# EAGLE board Rev 1 (EAGLE 9.2.2), part 1 of 2
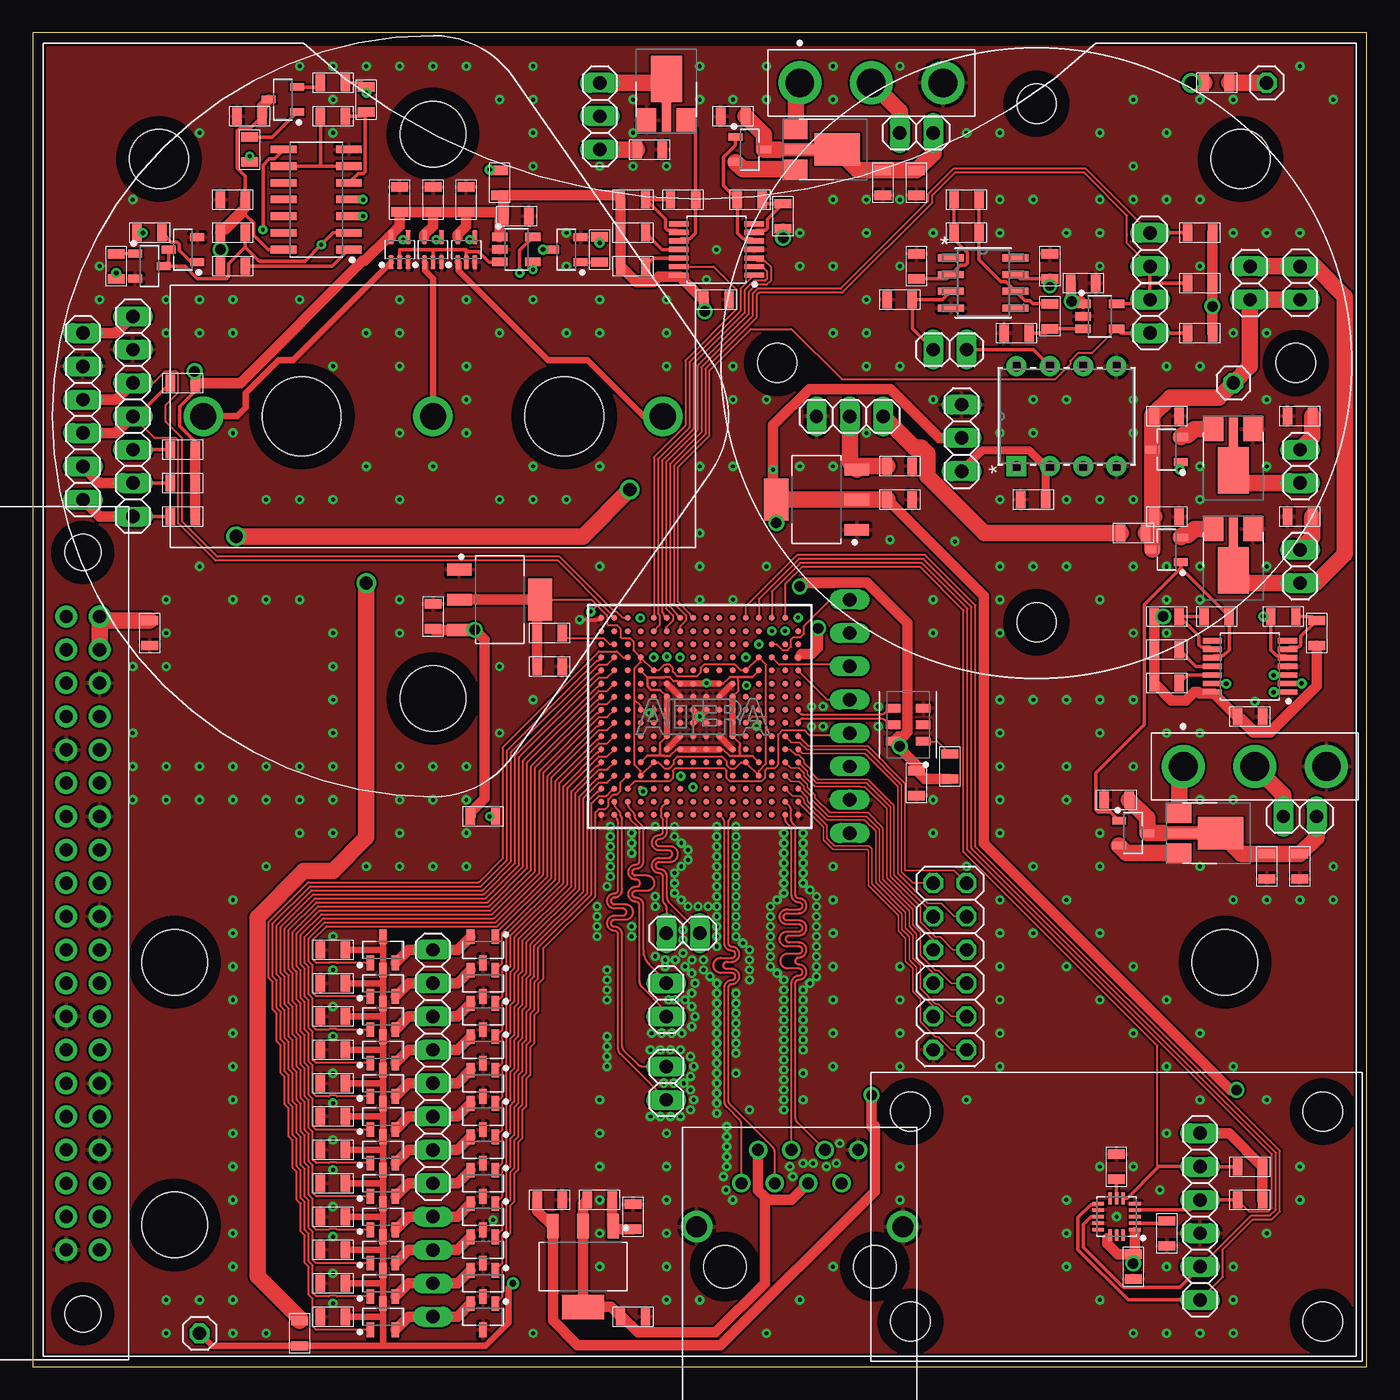
[diagram p12: board, top side]
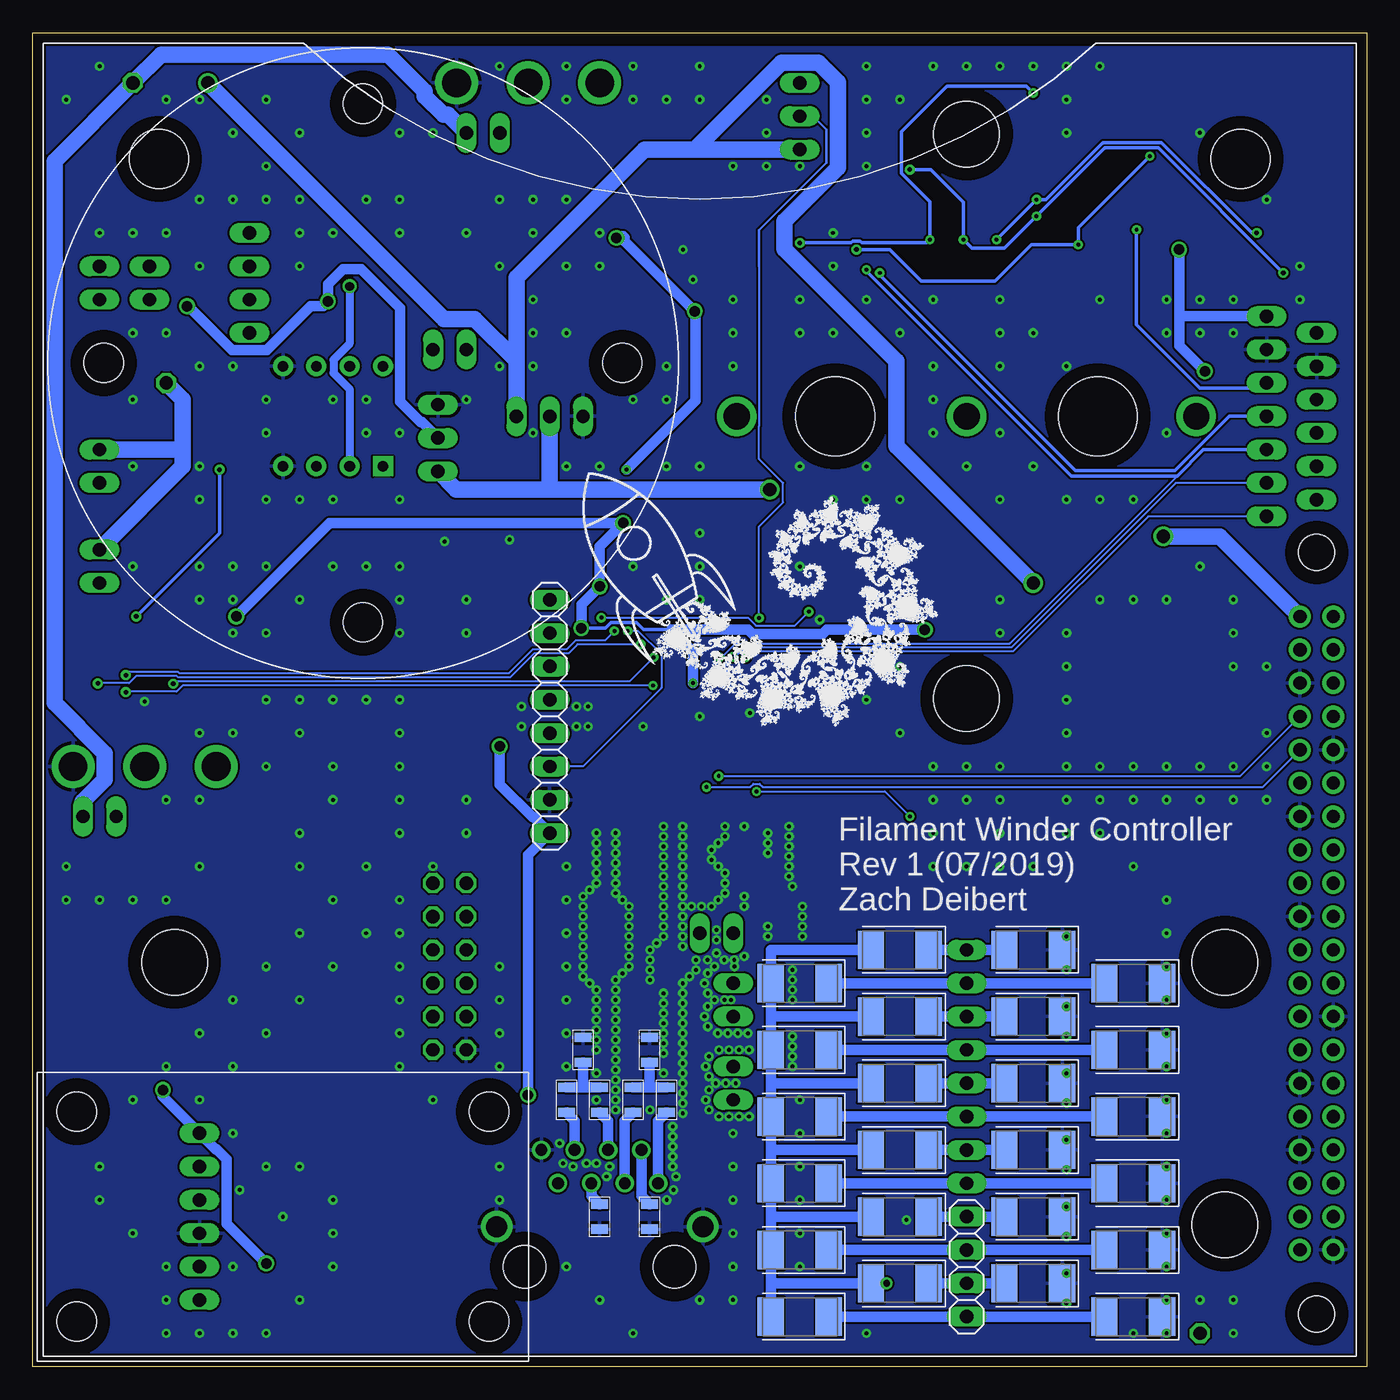
[diagram p13: board, bottom side, seen from below]

Size 101.6 x 101.6 mm. Coordinates in mm from the lower left corner, seen from the top.
Outline: 0,0 101.6,0 101.6,101.6 0,101.6 0,0
Copper layers (1*16): Top 0.035mm / dielectric 1.5mm / Bottom 0.035mm
Design rules "default *": minimum track width 5mil, minimum drill 0.3mm, track to track 6mil, track to pad 6mil, pad to pad 6mil, via to via 6mil, smd to smd 0mil, copper to edge 40mil, drill to drill 6mil, minimum pad ring 10mil, minimum via ring 8mil, stop-mask expansion 4mil, vias tented up to drill 0mil, thermal gap 10mil

## Footprints (pad centres in the part's own frame; a part is rotated, then mirrored left to right if it is on the bottom)
0805 = smd 0.711 x 1.295: P$1 -0.953,0; P$2 0.953,0
DIOC5327X220 = smd 2.002 x 2.915: 1 -2.203,0; 2 2.203,0
1X04 = drill 1.016 long: 1 -3.81,0; 2 -1.27,0; 3 1.27,0; 4 3.81,0
1X02 = drill 1.016 long: 1 -1.27,0; 2 1.27,0
1X03 = drill 1.016 long: 1 -2.54,0; 2 0,0; 3 2.54,0
1X06 = drill 1.016 long: 1 -6.35,0; 2 -3.81,0; 3 -1.27,0; 4 1.27,0; 5 3.81,0; 6 6.35,0
2X06 = drill 1.016 octagon: 1 -6.35,-1.27; 2 -6.35,1.27; 3 -3.81,-1.27; 4 -3.81,1.27; 5 -1.27,-1.27; 6 -1.27,1.27; 7 1.27,-1.27; 8 1.27,1.27; 9 3.81,-1.27; 10 3.81,1.27; 11 6.35,-1.27; 12 6.35,1.27
1X07 = drill 1.016 long: 1 -7.62,0; 2 -5.08,0; 3 -2.54,0; 4 0,0; 5 2.54,0; 6 5.08,0; 7 7.62,0
1X08 = drill 1.016 long: 1 -8.89,0; 2 -6.35,0; 3 -3.81,0; 4 -1.27,0; 5 1.27,0; 6 3.81,0; 7 6.35,0; 8 8.89,0
1X01 = drill 1.016 octagon: 1 0,0
5-2301994-4 = drill 1.6: G1 -7.85,-4.57; G2 7.85,-4.57 | drill 0.9: P1 -4.445,-1.27; P2 -3.175,1.27; P3 -1.905,-1.27; P4 -0.635,1.27; P5 0.635,-1.27; P6 1.905,1.27; P7 3.175,-1.27; P8 4.445,1.27 | hole 3.25: -5.715,-7.62; 5.715,-7.62
SOT23-3 = smd 1.122 x 0.582: 1 -1,0.95; 2 -1,-0.95; 3 1,0
SOT150P400X160-4 = smd 1.8 x 1.45: 1 -1.569,1.5; 3 -1.569,-1.5 | smd 4.9 x 0.7: 2 0,0 | smd 3.5 x 2.4: 4 1.569,0
SOT95P230X110-3 = smd 1.059 x 0.59: 1 -1.078,0.95; 2 -1.078,-0.95; 3 1.078,0
HDRV3W140P545_1X3_1560X508X838B = drill 2.18 pad 3.27: 1 0,0; 2 5.45,0; 3 10.9,0
POTENTIOMETER = drill 2 pad 3: P$1 0,0
FBGA256 = smd 0.45 x 0.45: A1 -7.5,7.5; A2 -6.5,7.5; A3 -5.5,7.5; A4 -4.5,7.5; A5 -3.5,7.5; A6 -2.5,7.5; A7 -1.5,7.5; A8 -0.5,7.5; A9 0.5,7.5; A10 1.5,7.5; A11 2.5,7.5; A12 3.5,7.5; A13 4.5,7.5; A14 5.5,7.5; A15 6.5,7.5; A16 7.5,7.5; B1 -7.5,6.5; B2 -6.5,6.5; B3 -5.5,6.5; B4 -4.5,6.5; B5 -3.5,6.5; B6 -2.5,6.5; B7 -1.5,6.5; B8 -0.5,6.5; B9 0.5,6.5; B10 1.5,6.5; B11 2.5,6.5; B12 3.5,6.5; B13 4.5,6.5; B14 5.5,6.5; B15 6.5,6.5; B16 7.5,6.5; C1 -7.5,5.5; C2 -6.5,5.5; C3 -5.5,5.5; C4 -4.5,5.5; C5 -3.5,5.5; C6 -2.5,5.5; C7 -1.5,5.5; C8 -0.5,5.5; C9 0.5,5.5; C10 1.5,5.5; C11 2.5,5.5; C12 3.5,5.5; C13 4.5,5.5; C14 5.5,5.5; C15 6.5,5.5; C16 7.5,5.5; D1 -7.5,4.5; D2 -6.5,4.5; D3 -5.5,4.5; D4 -4.5,4.5; D5 -3.5,4.5; D6 -2.5,4.5; D7 -1.5,4.5; D8 -0.5,4.5; D9 0.5,4.5; D10 1.5,4.5; D11 2.5,4.5; D12 3.5,4.5; D13 4.5,4.5; D14 5.5,4.5; D15 6.5,4.5; D16 7.5,4.5; E1 -7.5,3.5; E2 -6.5,3.5; E3 -5.5,3.5; E4 -4.5,3.5; E5 -3.5,3.5; E6 -2.5,3.5; E7 -1.5,3.5; E8 -0.5,3.5; E9 0.5,3.5; E10 1.5,3.5; E11 2.5,3.5; E12 3.5,3.5; E13 4.5,3.5; E14 5.5,3.5; E15 6.5,3.5; E16 7.5,3.5; F1 -7.5,2.5; F2 -6.5,2.5; F3 -5.5,2.5; F4 -4.5,2.5; F5 -3.5,2.5; F6 -2.5,2.5; F7 -1.5,2.5; F8 -0.5,2.5; F9 0.5,2.5; F10 1.5,2.5; F11 2.5,2.5; F12 3.5,2.5; F13 4.5,2.5; F14 5.5,2.5; F15 6.5,2.5; F16 7.5,2.5; G1 -7.5,1.5; G2 -6.5,1.5; G3 -5.5,1.5; G4 -4.5,1.5; G5 -3.5,1.5; G6 -2.5,1.5; G7 -1.5,1.5; G8 -0.5,1.5; G9 0.5,1.5; G10 1.5,1.5; G11 2.5,1.5; G12 3.5,1.5; G13 4.5,1.5; G14 5.5,1.5; G15 6.5,1.5; G16 7.5,1.5; H1 -7.5,0.5; H2 -6.5,0.5; H3 -5.5,0.5; H4 -4.5,0.5; H5 -3.5,0.5; H6 -2.5,0.5; H7 -1.5,0.5; H8 -0.5,0.5; H9 0.5,0.5; H10 1.5,0.5; H11 2.5,0.5; H12 3.5,0.5; H13 4.5,0.5; H14 5.5,0.5; H15 6.5,0.5; H16 7.5,0.5; J1 -7.5,-0.5; J2 -6.5,-0.5; J3 -5.5,-0.5; J4 -4.5,-0.5; J5 -3.5,-0.5; J6 -2.5,-0.5; J7 -1.5,-0.5; J8 -0.5,-0.5; J9 0.5,-0.5; J10 1.5,-0.5; J11 2.5,-0.5; J12 3.5,-0.5; J13 4.5,-0.5; J14 5.5,-0.5; J15 6.5,-0.5; J16 7.5,-0.5; K1 -7.5,-1.5; K2 -6.5,-1.5; K3 -5.5,-1.5; K4 -4.5,-1.5; K5 -3.5,-1.5; K6 -2.5,-1.5; K7 -1.5,-1.5; K8 -0.5,-1.5; K9 0.5,-1.5; K10 1.5,-1.5; K11 2.5,-1.5; K12 3.5,-1.5; K13 4.5,-1.5; K14 5.5,-1.5; K15 6.5,-1.5; K16 7.5,-1.5; L1 -7.5,-2.5; L2 -6.5,-2.5; L3 -5.5,-2.5; L4 -4.5,-2.5; L5 -3.5,-2.5; L6 -2.5,-2.5; L7 -1.5,-2.5; L8 -0.5,-2.5; L9 0.5,-2.5; L10 1.5,-2.5; L11 2.5,-2.5; L12 3.5,-2.5; L13 4.5,-2.5; L14 5.5,-2.5; L15 6.5,-2.5; L16 7.5,-2.5; M1 -7.5,-3.5; M2 -6.5,-3.5; M3 -5.5,-3.5; M4 -4.5,-3.5; M5 -3.5,-3.5; M6 -2.5,-3.5; M7 -1.5,-3.5; M8 -0.5,-3.5; M9 0.5,-3.5; M10 1.5,-3.5; M11 2.5,-3.5; M12 3.5,-3.5; M13 4.5,-3.5; M14 5.5,-3.5; M15 6.5,-3.5; M16 7.5,-3.5; N1 -7.5,-4.5; N2 -6.5,-4.5; N3 -5.5,-4.5; N4 -4.5,-4.5; N5 -3.5,-4.5; N6 -2.5,-4.5; N7 -1.5,-4.5; N8 -0.5,-4.5; N9 0.5,-4.5; N10 1.5,-4.5; N11 2.5,-4.5; N12 3.5,-4.5; N13 4.5,-4.5; N14 5.5,-4.5; N15 6.5,-4.5; N16 7.5,-4.5; P1 -7.5,-5.5; P2 -6.5,-5.5; P3 -5.5,-5.5; P4 -4.5,-5.5; P5 -3.5,-5.5; P6 -2.5,-5.5; P7 -1.5,-5.5; P8 -0.5,-5.5; P9 0.5,-5.5; P10 1.5,-5.5; P11 2.5,-5.5; P12 3.5,-5.5; P13 4.5,-5.5; P14 5.5,-5.5; P15 6.5,-5.5; P16 7.5,-5.5; R1 -7.5,-6.5; R2 -6.5,-6.5; R3 -5.5,-6.5; R4 -4.5,-6.5; R5 -3.5,-6.5; R6 -2.5,-6.5; R7 -1.5,-6.5; R8 -0.5,-6.5; R9 0.5,-6.5; R10 1.5,-6.5; R11 2.5,-6.5; R12 3.5,-6.5; R13 4.5,-6.5; R14 5.5,-6.5; R15 6.5,-6.5; R16 7.5,-6.5; T1 -7.5,-7.5; T2 -6.5,-7.5; T3 -5.5,-7.5; T4 -4.5,-7.5; T5 -3.5,-7.5; T6 -2.5,-7.5; T7 -1.5,-7.5; T8 -0.5,-7.5; T9 0.5,-7.5; T10 1.5,-7.5; T11 2.5,-7.5; T12 3.5,-7.5; T13 4.5,-7.5; T14 5.5,-7.5; T15 6.5,-7.5; T16 7.5,-7.5
SOP65P640X120-14 = smd 1.469 x 0.407: 1 -2.871,1.95; 2 -2.871,1.3; 3 -2.871,0.65; 4 -2.871,0; 5 -2.871,-0.65; 6 -2.871,-1.3; 7 -2.871,-1.95; 8 2.871,-1.95; 9 2.871,-1.3; 10 2.871,-0.65; 11 2.871,0; 12 2.871,0.65; 13 2.871,1.3; 14 2.871,1.95
16QFN = smd 0.904 x 0.264: 1 -1.404,1; 2 -1.404,0.5; 3 -1.404,0; 4 -1.404,-0.5; 5 -1.404,-1; 9 1.404,-1; 10 1.404,-0.5; 11 1.404,0; 12 1.404,0.5; 13 1.404,1 | smd 0.264 x 0.904: 6 -0.5,-1.404; 7 0,-1.404; 8 0.5,-1.404; 14 0.5,1.404; 15 0,1.404; 16 -0.5,1.404
TSSOP5 = smd 1.062 x 0.397: 1 -0.956,0.65; 2 -0.956,0; 3 -0.956,-0.65; 4 0.956,-0.65; 5 0.956,0.65
SOT23-5 = smd 1.186 x 0.639: 1 -1.264,0.95; 2 -1.264,0; 3 -1.264,-0.95; 4 1.264,-0.95; 5 1.264,0.95
SOIC127P600X175-14 = smd 1.952 x 0.589: 1 -2.482,3.81; 2 -2.482,2.54; 3 -2.482,1.27; 4 -2.482,0; 5 -2.482,-1.27; 6 -2.482,-2.54; 7 -2.482,-3.81; 8 2.482,-3.81; 9 2.482,-2.54; 10 2.482,-1.27; 11 2.482,0; 12 2.482,1.27; 13 2.482,2.54; 14 2.482,3.81
RPI = drill 1 pad 1.676: 1 -1.27,24.13; 2 1.27,24.13; 3 -1.27,21.59; 4 1.27,21.59; 5 -1.27,19.05; 6 1.27,19.05; 7 -1.27,16.51; 8 1.27,16.51; 9 -1.27,13.97; 10 1.27,13.97; 11 -1.27,11.43; 12 1.27,11.43; 13 -1.27,8.89; 14 1.27,8.89; 15 -1.27,6.35; 16 1.27,6.35; 17 -1.27,3.81; 18 1.27,3.81; 19 -1.27,1.27; 20 1.27,1.27; 21 -1.27,-1.27; 22 1.27,-1.27; 23 -1.27,-3.81; 24 1.27,-3.81; 25 -1.27,-6.35; 26 1.27,-6.35; 27 -1.27,-8.89; 28 1.27,-8.89; 29 -1.27,-11.43; 30 1.27,-11.43; 31 -1.27,-13.97; 32 1.27,-13.97; 33 -1.27,-16.51; 34 1.27,-16.51; 35 -1.27,-19.05; 36 1.27,-19.05; 37 -1.27,-21.59; 38 1.27,-21.59; 39 -1.27,-24.13; 40 1.27,-24.13 | hole 2.75: 0,29; 0,-29
SOT230P700X180-4 = smd 1.86 x 0.898: 1 -3.075,2.3; 2 -3.075,0; 3 -3.075,-2.3 | smd 1.86 x 3.189: 4 3.075,0
N_8 = drill 0.813 pad 1.524 square: 1 -7.62,7.62 | drill 0.813 pad 1.524: 2 -7.62,5.08; 3 -7.62,2.54; 4 -7.62,0; 5 0,0; 6 0,2.54; 7 0,5.08; 8 0,7.62
SO-8_S = smd 1.981 x 0.533: 1 -2.464,1.905; 2 -2.464,0.635; 3 -2.464,-0.635; 4 -2.464,-1.905; 5 2.464,-1.905; 6 2.464,-0.635; 7 2.464,0.635; 8 2.464,1.905
PCB_ACCEL = hole 3: -8,15.7; 8,15.7; -8,-15.7; 8,-15.7
PCB_MAIN = hole 5: -40,-40; -40,-20; 40,-20 | hole 4.5: -41.2,41.2; 41.2,41.2
PCB_POT = hole 6: -10,0; 10,0 | hole 5: 0,21.5; 0,-21.5
PCB_CARVER = hole 3: 0,19.75; 0,-19.75; 19.75,0; -19.75,0
ICDFN500X320X90-4 = smd 0.64 x 1.1: P1 -1.27,-1.15; P2 0,-1.15; P3 1.27,-1.15; P4 1.27,1.15; P5 0,1.15; P6 -1.27,1.15

## Placement (x,y rotation side)
C1  0.1uF  [0805]  22.86,3.81 0 top
C2  0.1uF  [0805]  22.86,6.35 0 top
C3  0.1uF  [0805]  22.86,8.89 0 top
C4  0.1uF  [0805]  22.86,11.43 0 top
C5  0.1uF  [0805]  22.86,13.97 0 top
C6  0.1uF  [0805]  22.86,16.51 0 top
C7  0.1uF  [0805]  22.86,19.05 0 top
C8  0.1uF  [0805]  22.86,21.59 0 top
C9  0.1uF  [0805]  22.86,24.13 0 top
C10  0.1uF  [0805]  22.86,26.67 0 top
C11  0.1uF  [0805]  22.86,29.21 0 top
C12  0.1uF  [0805]  22.86,31.75 0 top
C13  0.1uF  [0805]  92.71,49.53 180 top
C14  0.1uF  [0805]  86.36,64.77 180 top
C15  0.1uF  [0805]  96.52,64.77 0 top
C16  0.1uF  [0805]  86.36,72.39 180 top
C17  0.1uF  [0805]  96.52,72.39 0 top
C18  0.1uF  [0805]  52.07,81.28 180 top
C19  0.1uF  [0805]  64.77,90.17 90 top
C20  0.1uF  [0805]  53.34,95.25 0 top
C21  0.1uF  [0805]  93.98,38.1 90 top
C22  0.1uF  [0805]  82.55,43.18 0 top
C23  0.1uF  [0805]  96.52,38.1 90 top
C24  0.1uF  [0805]  67.31,90.17 90 top
C25  0.1uF  [0805]  86.36,10.16 90 top
C26  0.1uF  [0805]  83.82,7.62 90 top
C27  0.1uF  [0805]  33.02,88.9 270 top
C28  0.1uF  [0805]  30.48,88.9 270 top
C29  0.1uF  [0805]  27.94,88.9 270 top
C30  0.1uF  [0805]  36.83,87.63 180 top
C31  0.1uF  [0805]  15.24,88.9 0 top
C32  0.1uF  [0805]  16.51,95.25 0 top
C33  1uF  [0805]  8.89,55.88 90 top
C34  0.1uF  [0805]  67.31,44.45 90 top
C35  0.1uF  [0805]  54.61,24.13 270 bottom
C36  0.1uF  [0805]  59.69,24.13 270 bottom
C37  0.1uF  [0805]  58.42,11.43 90 bottom
C38  0.1uF  [0805]  54.61,11.43 90 bottom
C39  1uF  [0805]  66.04,68.58 180 top
C40  1uF  [0805]  66.04,66.04 180 top
C41  1uF  [0805]  39.37,12.7 180 top
C42  1uF  [0805]  45.72,3.81 180 top
C43  1uF  [0805]  30.48,57.15 270 top
C44  1uF  [0805]  39.37,53.34 180 top
C45  0.1uF  [0805]  76.2,66.04 0 top
C46  0.1uF  [0805]  66.04,81.28 0 top
C47  0.1uF  [0805]  77.47,83.82 270 top
C48  68nF  [0805]  71.12,88.9 0 top
C49  0.1uF  [0805]  80.01,82.55 180 top
C50  0.1uF  [0805]  46.99,92.71 180 top
D1  M7  [DIOC5327X220]  43.18,3.81 180 bottom
D2  M7  [DIOC5327X220]  17.78,3.81 180 bottom
D3  M7  [DIOC5327X220]  35.56,6.35 180 bottom
D4  M7  [DIOC5327X220]  25.4,6.35 180 bottom
D5  M7  [DIOC5327X220]  43.18,8.89 180 bottom
D6  M7  [DIOC5327X220]  17.78,8.89 180 bottom
D7  M7  [DIOC5327X220]  35.56,11.43 180 bottom
D8  M7  [DIOC5327X220]  25.4,11.43 180 bottom
D9  M7  [DIOC5327X220]  43.18,13.97 180 bottom
D10  M7  [DIOC5327X220]  17.78,13.97 180 bottom
D11  M7  [DIOC5327X220]  35.56,16.51 180 bottom
D12  M7  [DIOC5327X220]  25.4,16.51 180 bottom
D13  M7  [DIOC5327X220]  43.18,19.05 180 bottom
D14  M7  [DIOC5327X220]  17.78,19.05 180 bottom
D15  M7  [DIOC5327X220]  35.56,21.59 180 bottom
D16  M7  [DIOC5327X220]  25.4,21.59 180 bottom
D17  M7  [DIOC5327X220]  43.18,24.13 180 bottom
D18  M7  [DIOC5327X220]  17.78,24.13 180 bottom
D19  M7  [DIOC5327X220]  35.56,26.67 180 bottom
D20  M7  [DIOC5327X220]  25.4,26.67 180 bottom
D21  M7  [DIOC5327X220]  43.18,29.21 180 bottom
D22  M7  [DIOC5327X220]  17.78,29.21 180 bottom
D23  M7  [DIOC5327X220]  35.56,31.75 180 bottom
D24  M7  [DIOC5327X220]  25.4,31.75 180 bottom
JP1  [1X04]  30.48,7.62 90 bottom
JP2  [1X04]  30.48,17.78 90 top
JP3  [1X04]  30.48,27.94 90 top
JP4  [1X02]  96.52,60.96 270 top
JP5  [1X02]  96.52,68.58 270 top
JP6  [1X03]  43.18,95.25 90 top
JP7  [1X02]  67.31,93.98 180 top
JP8  [1X02]  96.52,41.91 180 top
JP9  [1X06]  88.9,11.43 270 top
JP10  [2X06]  69.85,30.48 270 top
JP11  [1X06]  3.81,72.39 270 top
JP12  [1X07]  7.62,72.39 270 top
JP13  [1X03]  70.74,70.74 90 top
JP14  [1X08]  62.23,49.53 270 bottom
JP15  [1X01]  12.7,2.54 0 top
JP16  [1X01]  91.44,74.93 0 top
JP17  [1X01]  93.98,97.79 0 top
JP18  [1X03]  62.23,72.39 180 top
JP19  [1X02]  49.53,33.02 180 top
JP20  [1X02]  48.26,27.94 270 top
JP21  [1X02]  48.26,21.59 270 top
JP22  [1X02]  92.71,82.55 90 top
JP23  [1X02]  96.52,82.55 270 top
JP24  [1X02]  69.85,77.47 180 top
JP25  [1X02]  85.09,85.09 90 top
JP26  [1X02]  85.09,80.01 270 top
P1  5-2301994-4  [5-2301994-4]  58.42,15.24 0 top
Q1  BCV27  [SOT23-3]  26.67,3.81 90 top
Q2  BCV26SOT23  [SOT23-3]  34.29,3.81 270 top
Q3  BCV27  [SOT23-3]  26.67,6.35 90 top
Q4  BCV26SOT23  [SOT23-3]  34.29,6.35 270 top
Q5  BCV27  [SOT23-3]  26.67,8.89 90 top
Q6  BCV26SOT23  [SOT23-3]  34.29,8.89 270 top
Q7  BCV27  [SOT23-3]  26.67,11.43 90 top
Q8  BCV26SOT23  [SOT23-3]  34.29,11.43 270 top
Q9  BCV27  [SOT23-3]  26.67,13.97 90 top
Q10  BCV26SOT23  [SOT23-3]  34.29,13.97 270 top
Q11  BCV27  [SOT23-3]  26.67,16.51 90 top
Q12  BCV26SOT23  [SOT23-3]  34.29,16.51 270 top
Q13  BCV27  [SOT23-3]  26.67,19.05 90 top
Q14  BCV26SOT23  [SOT23-3]  34.29,19.05 270 top
Q15  BCV27  [SOT23-3]  26.67,21.59 90 top
Q16  BCV26SOT23  [SOT23-3]  34.29,21.59 270 top
Q17  BCV27  [SOT23-3]  26.67,24.13 90 top
Q18  BCV26SOT23  [SOT23-3]  34.29,24.13 270 top
Q19  BCV27  [SOT23-3]  26.67,26.67 90 top
Q20  BCV26SOT23  [SOT23-3]  34.29,26.67 270 top
Q21  BCV27  [SOT23-3]  26.67,29.21 90 top
Q22  BCV26SOT23  [SOT23-3]  34.29,29.21 270 top
Q23  BCV27  [SOT23-3]  26.67,31.75 90 top
Q24  BCV26SOT23  [SOT23-3]  34.29,31.75 270 top
Q25  PBSS4360XFPBSS4360XF  [SOT150P400X160-4]  91.44,62.23 270 top
Q26  MMBT3904,215MMBT3904,215  [SOT95P230X110-3]  86.36,62.23 180 top
Q27  PBSS4360XFPBSS4360XF  [SOT150P400X160-4]  91.44,69.85 270 top
Q28  MMBT3904,215MMBT3904,215  [SOT95P230X110-3]  86.36,69.85 180 top
Q29  PBSS4360XFPBSS4360XF  [SOT150P400X160-4]  48.26,96.52 90 top
Q30  TIP35CTIP35C  [HDRV3W140P545_1X3_1560X508X838B]  58.42,97.79 0 top
Q31  PBSS4360XFPBSS4360XF  [SOT150P400X160-4]  59.69,92.71 0 top
Q32  MMBT3904,215MMBT3904,215  [SOT95P230X110-3]  54.61,92.71 0 top
Q33  TIP35CTIP35C  [HDRV3W140P545_1X3_1560X508X838B]  87.63,45.72 0 top
Q34  PBSS4360XFPBSS4360XF  [SOT150P400X160-4]  88.9,40.64 0 top
Q35  MMBT3904,215MMBT3904,215  [SOT95P230X110-3]  83.82,40.64 0 top
Q36  MMBT3904,215MMBT3904,215  [SOT95P230X110-3]  8.89,83.82 0 top
Q37  MMBT3904,215MMBT3904,215  [SOT95P230X110-3]  11.43,85.09 180 top
Q38  MMBT3904,215MMBT3904,215  [SOT95P230X110-3]  40.64,85.09 180 top
Q39  MMBT3904,215MMBT3904,215  [SOT95P230X110-3]  19.05,96.52 180 top
R1  10k  [0805]  86.36,52.07 180 top
R2  10k  [0805]  86.36,54.61 180 top
R3  4.2k  [0805]  86.36,57.15 180 top
R4  1M  [0805]  90.17,57.15 180 top
R5  1.4k  [0805]  97.79,55.88 270 top
R6  1M  [0805]  95.25,57.15 0 top
R7  10k  [0805]  45.72,83.82 180 top
R8  10k  [0805]  45.72,86.36 180 top
R9  4.2k  [0805]  45.72,88.9 180 top
R10  1M  [0805]  49.53,88.9 180 top
R11  1.4k  [0805]  57.15,87.63 270 top
R12  1M  [0805]  54.61,88.9 0 top
R13  10k  [0805]  82.55,15.24 270 top
R14  4.7k  [0805]  92.71,12.7 0 top
R15  4.7k  [0805]  92.71,15.24 0 top
R16  POTENTIOMETER  [POTENTIOMETER]  47.98,72.39 180 top
R17  POTENTIOMETER  [POTENTIOMETER]  30.48,72.39 180 top
R18  POTENTIOMETER  [POTENTIOMETER]  12.98,72.39 180 top
R19  10k  [0805]  15.24,83.82 180 top
R20  10k  [0805]  15.24,86.36 180 top
R21  10k  [0805]  6.35,83.82 90 top
R22  10k  [0805]  8.89,86.36 0 top
R23  0R  [0805]  25.4,96.52 90 top
R24  0R  [0805]  22.86,95.25 180 top
R25  10k  [0805]  43.18,85.09 270 top
R26  1k  [0805]  16.51,92.71 90 top
R27  0R  [0805]  22.86,97.79 0 top
R28  10k  [0805]  35.56,90.17 270 top
R29  10k  [0805]  69.85,45.72 270 top
R30  49.9R  [0805]  53.34,20.32 270 bottom
R31  49.9R  [0805]  55.88,20.32 270 bottom
R32  49.9R  [0805]  58.42,20.32 270 bottom
R33  10k  [0805]  34.29,41.91 180 top
R34  10k  [0805]  39.37,55.88 180 top
R35  49.9R  [0805]  60.96,20.32 270 bottom
R36  2.4k  [0805]  43.18,12.7 180 top
R37  7.5k  [0805]  45.72,11.43 270 top
R38  0R  [0805]  20.32,2.54 270 top
R39  0R  [0805]  83.82,63.5 0 top
R40  0R  [0805]  90.17,97.79 0 top
R41  246k  [0805]  71.12,86.36 0 top
R42  1k  [0805]  67.31,83.82 270 top
R43  47k  [0805]  77.47,80.01 90 top
R44  91k  [0805]  74.93,78.74 0 top
R45  4.7k  [0805]  88.9,78.74 0 top
R46  4.7k  [0805]  88.9,82.55 0 top
R47  4.7k  [0805]  88.9,86.36 0 top
R48  4.7k  [0805]  11.43,67.31 0 top
R49  4.7k  [0805]  11.43,64.77 0 top
R50  4.7k  [0805]  11.43,69.85 0 top
R51  4.7k  [0805]  11.43,74.93 0 top
U1  LFXP6E-3FN256C  [FBGA256]  50.8,49.53 0 top
U2  MCP4251  [SOP65P640X120-14]  92.71,53.34 180 top
U3  MCP4251  [SOP65P640X120-14]  52.07,85.09 180 top
U4  MMA8453QR116QFN  [16QFN]  82.55,11.43 180 top
U5  74AHC1G66GW,125TSSOP6  [TSSOP5]  33.02,85.09 90 top
U6  74AHC1G66GW,125TSSOP6  [TSSOP5]  30.48,85.09 90 top
U7  74AHC1G66GW,125TSSOP6  [TSSOP5]  27.94,85.09 90 top
U8  MCP3021A1T-E/OTSOT23  [SOT23-5]  36.83,85.09 0 top
U9  MC74HC164BDR2GMC74HC164BDR2G  [SOIC127P600X175-14]  21.59,88.9 180 top
U10  RPI  [RPI]  3.81,33.02 0 top
U11  3.3V  [SOT230P700X180-4]  59.69,66.04 180 top
U12  3.3V  [SOT230P700X180-4]  41.91,7.62 270 top
U13  3.3V  [SOT230P700X180-4]  35.56,58.42 0 top
U14  LT1025CN8PBF  [N_8]  82.55,76.2 90 top
U15  LTC1049CS8#PBF  [SO-8_S]  72.39,82.55 0 top
U16  MCP3021A1T-E/OTSOT23  [SOT23-5]  81.28,80.01 0 top
U$1  PCB_ACCEL  [PCB_ACCEL]  82.55,11.43 90 top
U$2  PCB_MAIN  [PCB_MAIN]  50.8,50.8 0 top
U$3  PCB_POT  [PCB_POT]  30.48,72.39 180 top
U$4  PCB_CARVER  [PCB_CARVER]  76.45,76.45 0 top
Y1  DSC1122B  [ICDFN500X320X90-4]  66.67,48.9 90 top